# EAGLE design HVIBDC (EAGLE 9.5.1)
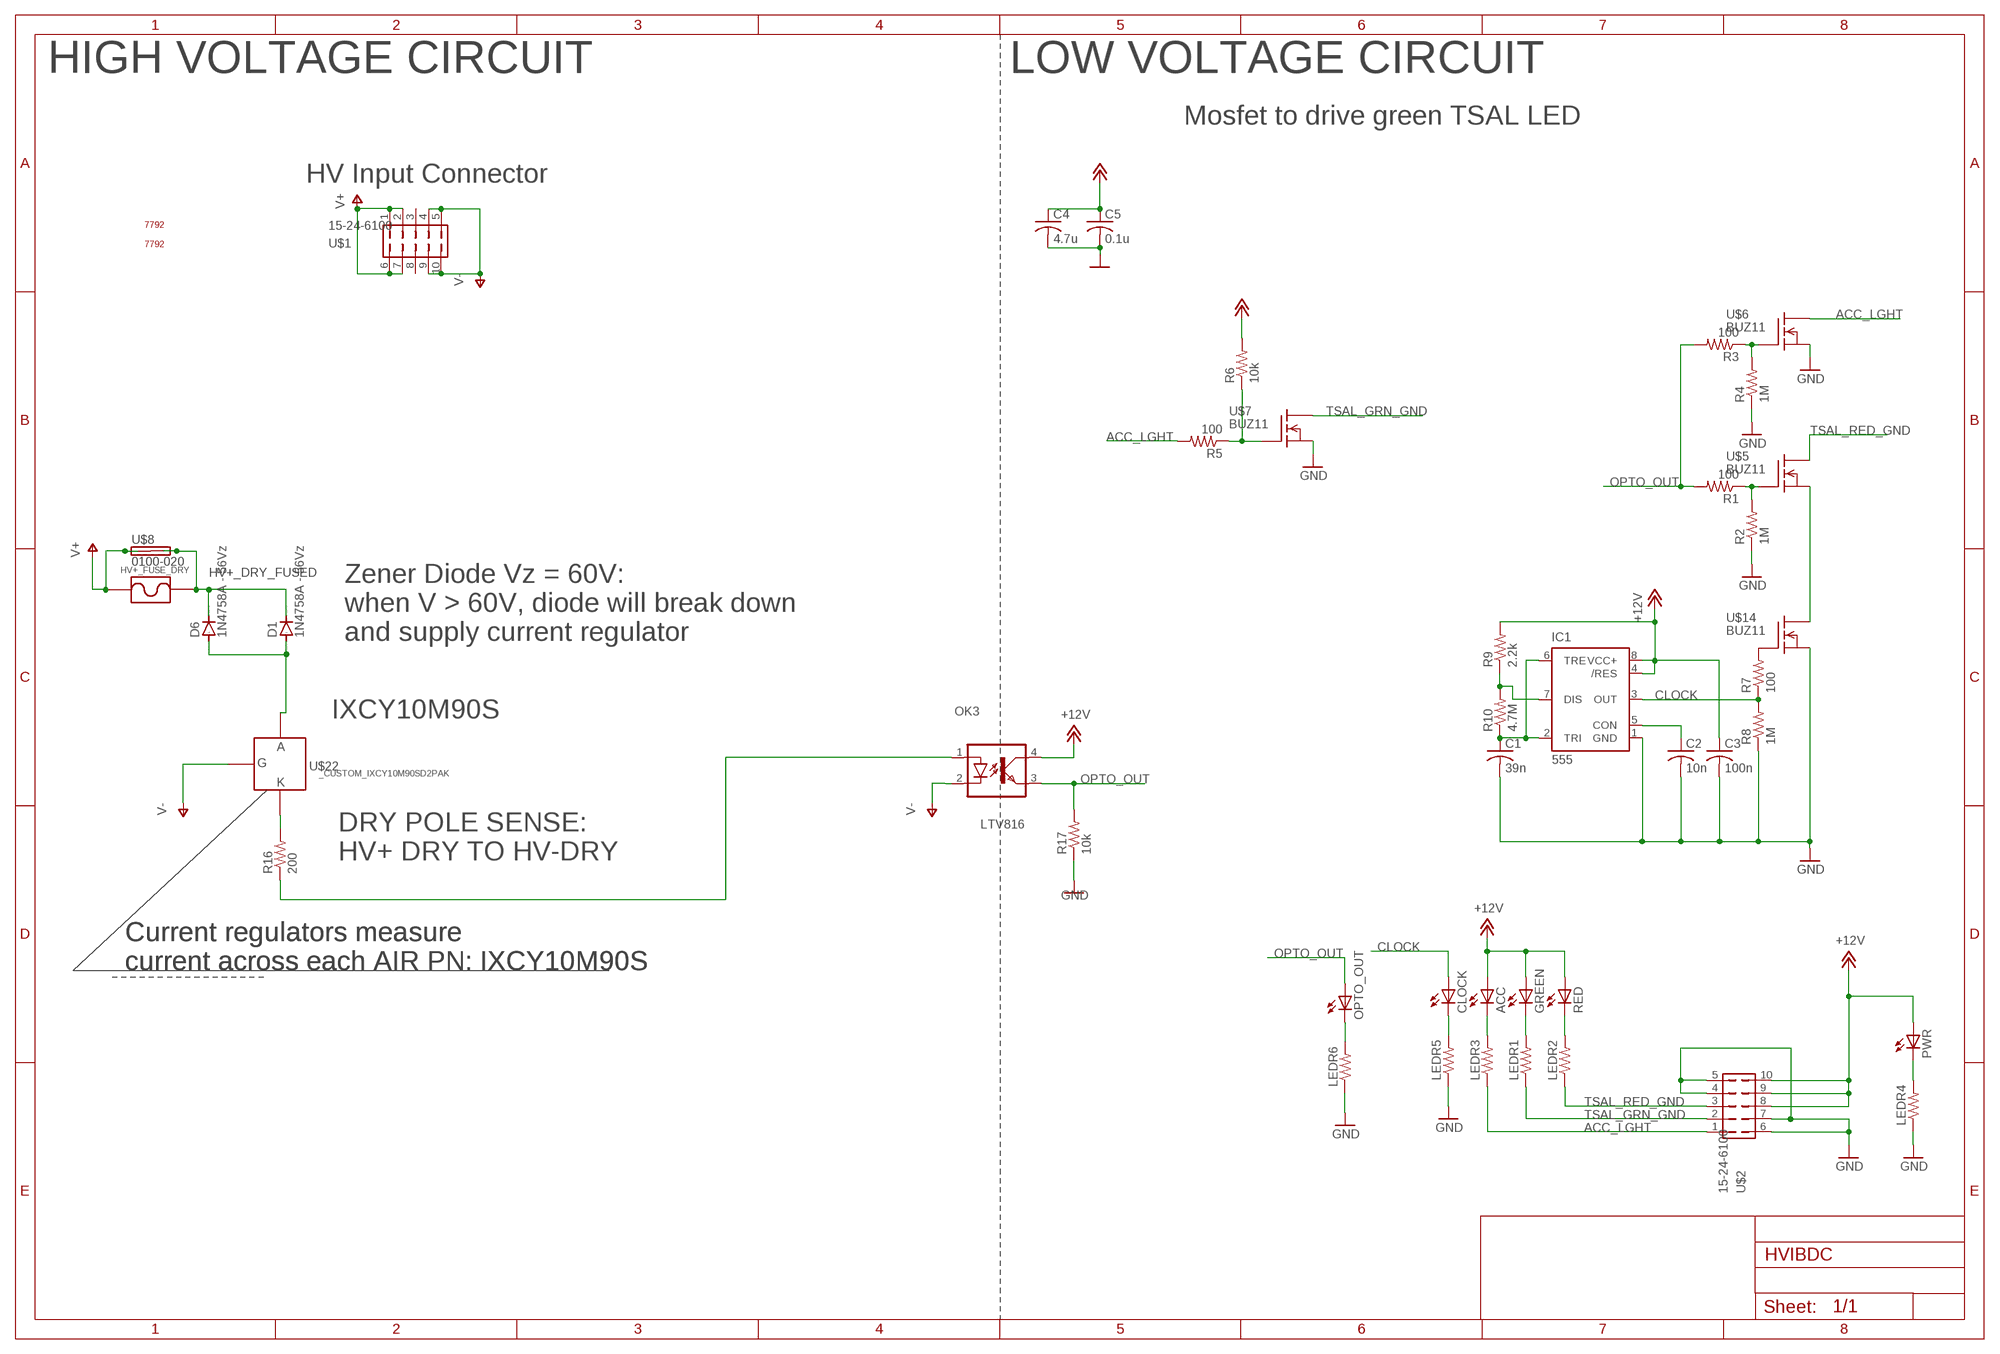
[diagram p0: schematic, sheet 1]

## Parts
ACC  LEDCHIPLED_0805  [CHIPLED_0805]
C1  39n  C-USC0805  [C0805]
C2  10n  C-USC0805  [C0805]
C3  100n  C-USC0805  [C0805]
C4  4.7u  C-USC0805  [C0805]
C5  0.1u  C-USC0805  [C0805]
CLOCK  LEDCHIPLED_0805  [CHIPLED_0805]
D1  1N4758A - 56Vz  1N5624  [DO201-15]
D6  1N4758A - 56Vz  1N5624  [DO201-15]
GREEN  LEDCHIPLED_0805  [CHIPLED_0805]
HV+_FUSE_DRY  _CUSTOM_PARTS_LF_885  [_CUSTOM_PARTS_LF_885]
IC1  555  555P  [DIP08]
LEDR1  R-US_R0805  [R0805]
LEDR2  R-US_R0805  [R0805]
LEDR3  R-US_R0805  [R0805]
LEDR4  R-US_R0805  [R0805]
LEDR5  R-US_R0805  [R0805]
LEDR6  R-US_R0805  [R0805]
OK3  LTV816  [DIL04]
OPTO_OUT  LEDCHIPLED_0805  [CHIPLED_0805]
PWR  LEDCHIPLED_0805  [CHIPLED_0805]
R1  100  R-US_R0805  [R0805]
R2  1M  R-US_R0805  [R0805]
R3  100  R-US_R0805  [R0805]
R4  1M  R-US_R0805  [R0805]
R5  100  R-US_R0805  [R0805]
R6  10k  R-US_R0805  [R0805]
R7  100  R-US_R0805  [R0805]
R8  1M  R-US_R0805  [R0805]
R9  2.2k  R-US_R0805  [R0805]
R10  4.7M  R-US_R0805  [R0805]
R16  200  R-US_R2010  [R2010]
R17  10k  R-US_R0805  [R0805]
RED  LEDCHIPLED_0805  [CHIPLED_0805]
U$1  15-24-6100  [15-24-6100]
U$2  15-24-6100  [15-24-6100]
U$3  7792  [7792]
U$4  7792  [7792]
U$5  BUZ11  [TO220]
U$6  BUZ11  [TO220]
U$7  BUZ11  [TO220]
U$8  0100-020  [0100-020]
U$14  BUZ11  [TO220]
U$22  _CUSTOM_IXCY10M90SD2PAK  [TO228P991X238-3]

## Nets
+12V: ACC.A C3.1 C4.1 C5.1 GREEN.A IC1.4(/RES) IC1.8(VCC+) OK3.4(COL) PWR.A R6.2 R9.2 RED.A U$2.8 U$2.9 U$2.10
ACC_LGHT: LEDR3.1 R5.2 U$2.1 U$6.2(D)
CLOCK: CLOCK.A IC1.3(OUT) R7.1 R8.2
GND: C1.2 C2.2 C3.2 C4.2 C5.2 IC1.1(GND) LEDR4.1 LEDR5.1 LEDR6.1 R2.1 R4.1 R8.1 R17.1 U$2.4 U$2.5 U$2.6 U$2.7 U$6.3(S) U$7.3(S) U$14.3(S)
HV+_DRY_FUSED [HV]: D1.C D6.C HV+_FUSE_DRY.P$1 U$8.P$2(2A) U$8.P$4(2B)
N$1: R1.1 R2.2 U$5.1(G)
N$2: R3.1 R4.2 U$6.1(G)
N$3: R5.1 R6.1 U$7.1(G)
N$4: C2.1 IC1.5(CON)
N$5: IC1.7(DIS) R9.1 R10.2
N$6: CLOCK.C LEDR5.2
N$7: R7.2 U$14.1(G)
N$8: LEDR6.2 OPTO_OUT.C
N$9: C1.1 IC1.2(TRI) IC1.6(TRE) R10.1
N$10: ACC.C LEDR3.2
N$12: GREEN.C LEDR1.2
N$13: U$5.3(S) U$14.2(D)
N$16: LEDR2.2 RED.C
N$17: LEDR4.2 PWR.C
N$20 [HV]: R16.2 U$22.2(K)
N$21 [HV]: D1.A D6.A U$22.3(A)
N$22 [HV]: OK3.1(A) R16.1
OPTO_OUT: OK3.3(EMIT) OPTO_OUT.A R1.2 R3.2 R17.2
TSAL_GRN_GND: LEDR1.1 U$2.2 U$7.2(D)
TSAL_RED_GND: LEDR2.1 U$2.3 U$5.2(D)
V+ [HV]: HV+_FUSE_DRY.P$2 U$1.1 U$1.2 U$1.6 U$1.7 U$8.P$1(1A) U$8.P$3(1B)
V- [HV]: OK3.2(C) U$1.4 U$1.5 U$1.9 U$1.10 U$22.1(G)
Unconnected: U$1.3 U$1.8

## Notes on the sheet
- HIGH VOLTAGE CIRCUIT | LOW VOLTAGE CIRCUIT
- Mosfet to drive green TSAL LED
- HV Input Connector
- Zener Diode Vz = 60V: 
  when V > 60V, diode will break down 
  and supply current regulator
- IXCY10M90S
- DRY POLE SENSE:
  HV+ DRY TO HV-DRY
- Current regulators measure 
  current across each AIR PN: IXCY10M90S
- Current regulators measure 
  current across each AIR PN: IXCY10M90S
- Current regulators measure 
  current across each AIR PN: IXCY10M90S

## Library data of the parts
ACC CLOCK GREEN OPTO_OUT PWR RED = ACC-MB-R0:LED: LED OSRAM: - CHIPLED LG R971, LG N971, LY N971, LG Q971, LY Q971, LO R971, LY R971 LH N974, LH R974 LS Q976, LO Q976, LY Q976 LO Q996 - Hyper CHIPLED LW Q18S LB Q993, LB Q99A, LB R99A - SideLED LS A670, LO A670, LY A670, LG A670, LP A670 LB A673, LV A673, LT A673, LW A673 LH A674 LY A675 LS A676, LA A676, LO A676, LY A676, LW A676 LS A679, LY A679, LG A679 - Hyper Micro SIDELED® LS Y876, LA Y876, LO Y876, LY Y876 LT Y87S - SmartLED LW L88C, LW L88S LB L89C, LB L89S, LG L890 LS L89K, LO L89K, LY L89K LS L896, LA L896, LO L896, LY L896 - TOPLED LS T670, LO T670, LY T670, LG T670, LP T670 LSG T670, LSP T670, LSY T670, LOP T670, LYG T670 LG T671, LOG T671, LSG T671 LB T673, LV T673, LT T673, LW T673 LH T674 LS T676, LA T676, LO T676, LY T676, LB T676, LH T676, LSB T676, LW T676 LB T67C, LV T67C, LT T67C, LS T67K, LO T67K, LY T67K, LW E67C LS E67B, LA E67B, LO E67B, LY E67B, LB E67C, LV E67C, LT E67C LW T67C LS T679, LY T679, LG T679 LS T770, LO T770, LY T770, LG T770, LP T770 LB T773, LV T773, LT T773, LW T773 LH T774 LS E675, LA E675, LY E675, LS T675 LS T776, LA T776, LO T776, LY T776, LB T776 LHGB T686 LT T68C, LB T68C - Hyper Mini TOPLED® LB M676 - Mini TOPLED Santana® LG M470 LS M47K, LO M47K, LY M47K Source: http://www.osram.convergy.de LUXEON: - LUMILED® LXK2-PW12-R00, LXK2-PW12-S00, LXK2-PW14-U00, LXK2-PW14-V00 LXK2-PM12-R00, LXK2-PM12-S00, LXK2-PM14-U00 LXK2-PE12-Q00, LXK2-PE12-R00, LXK2-PE12-S00, LXK2-PE14-T00, LXK2-PE14-U00 LXK2-PB12-K00, LXK2-PB12-L00, LXK2-PB12-M00, LXK2-PB14-N00, LXK2-PB14-P00, LXK2-PB14-Q00 LXK2-PR12-L00, LXK2-PR12-M00, LXK2-PR14-Q00, LXK2-PR14-R00 LXK2-PD12-Q00, LXK2-PD12-R00, LXK2-PD12-S00 LXK2-PH12-R00, LXK2-PH12-S00 LXK2-PL12-P00, LXK2-PL12-Q00, LXK2-PL12-R00 Source: www.luxeon.com KINGBRIGHT: KA-3528ASYC Source: www.kingbright.com
C1-C5 = resistor:C-US: CAPACITOR, American symbol
D1 D6 = diode:1N5624: DIODE controlled avalanche rectifier
HV+_FUSE_DRY = Main:_CUSTOM_PARTS_LF_885
IC1 = SparkFun-IC-Special-Function:555: General purpose bipolar Timer Datasheet <http://www.sparkfun.com/datasheets/Components/General/ne555.pdf> SparkFun Products SparkFun SparkPunk Sequencer Kit <https://www.sparkfun.com/products/12707> (KIT-12707) Storefront Component: 555 Timer <https://www.sparkfun.com/products/9273> (COM-09273) Two parts valid for production: VFP: IC-11930 (M7555 PTH) VFP: IC-09173 (555 PTH) - Preferred; PROD_ID: IC-09173; PROD_ID_ALT: IC-09173
LEDR1-LEDR6 = ACC-MB-R0:R-US_: RESISTOR, American symbol; SPICEPREFIX: R
OK3 = optocoupler:LTV816: OPTO COUPLER Source: LITEON, LTV816.pdf; OC_FARNELL: unknown; OC_NEWARK: unknown
R1-R10 R17 = resistor:R-US_: RESISTOR, American symbol
R16 = Main:R-US_: RESISTOR, American symbol; SPICEPREFIX: R
U$1 U$2 = ACC-MB-R0:15-24-6100
U$3 U$4 = ACC-MB-R0:7792
U$5-U$7 U$14 = transistor-fet:BUZ11: N-Channel Enhancement MOSFET 50V; 30A; 0,040Ohm
U$8 = ACC-MB-R0:0100-020
U$22 = Main:_CUSTOM_IXCY10M90S

## Net classes
0 default: width 0.2 mm, clearance 0.2 mm
2 HV: width 1.27 mm, clearance 1.5 mm to class 0, clearance 1.5 mm to class 1, clearance 1.5 mm

## Board
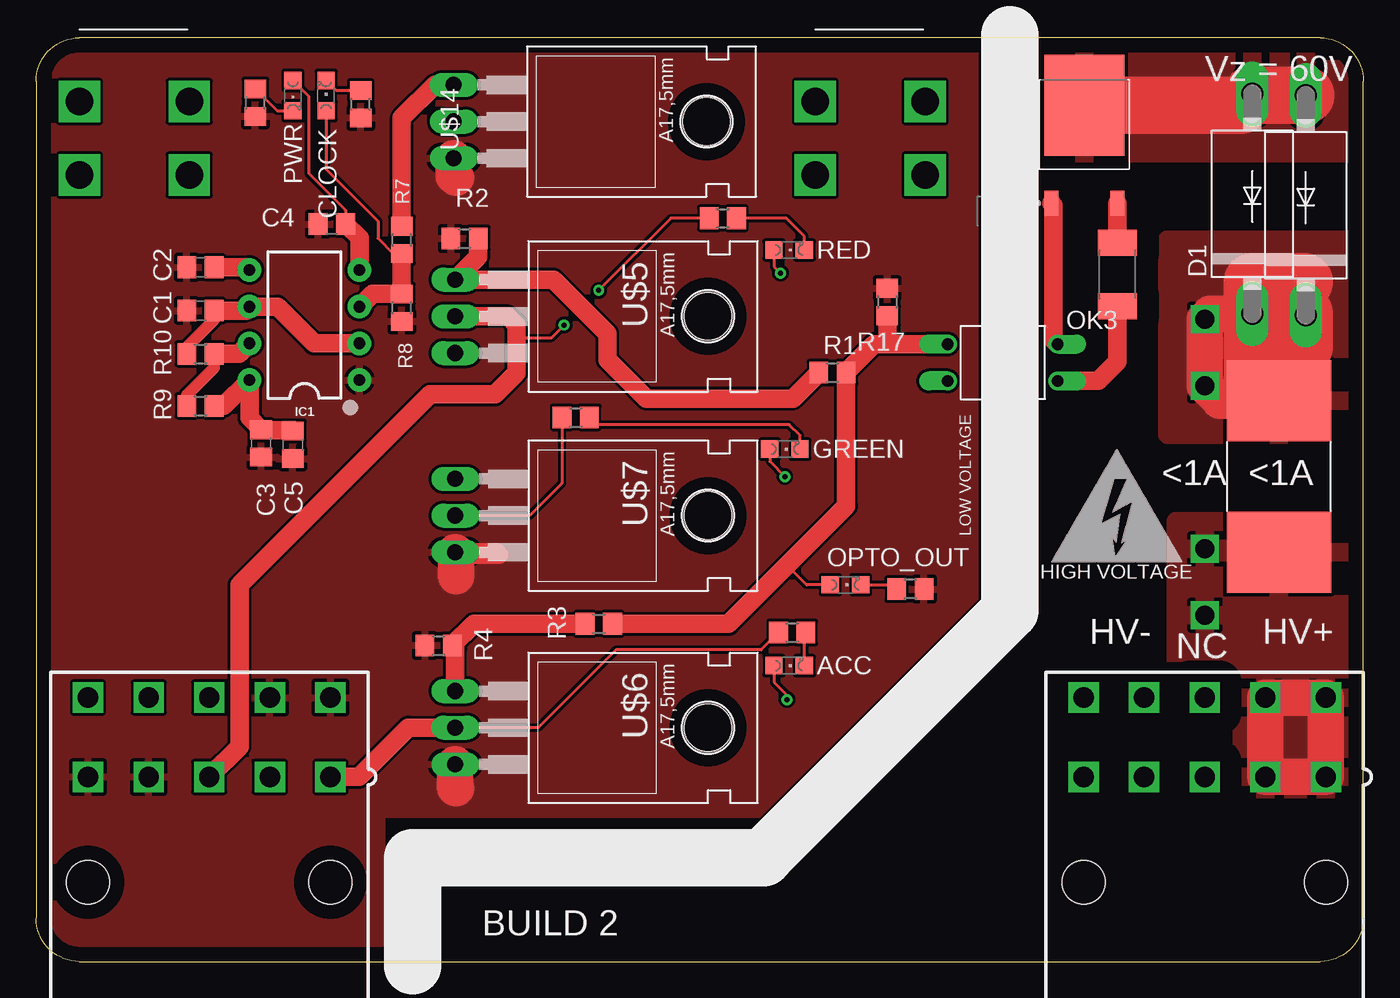
[diagram p1: board, top side]
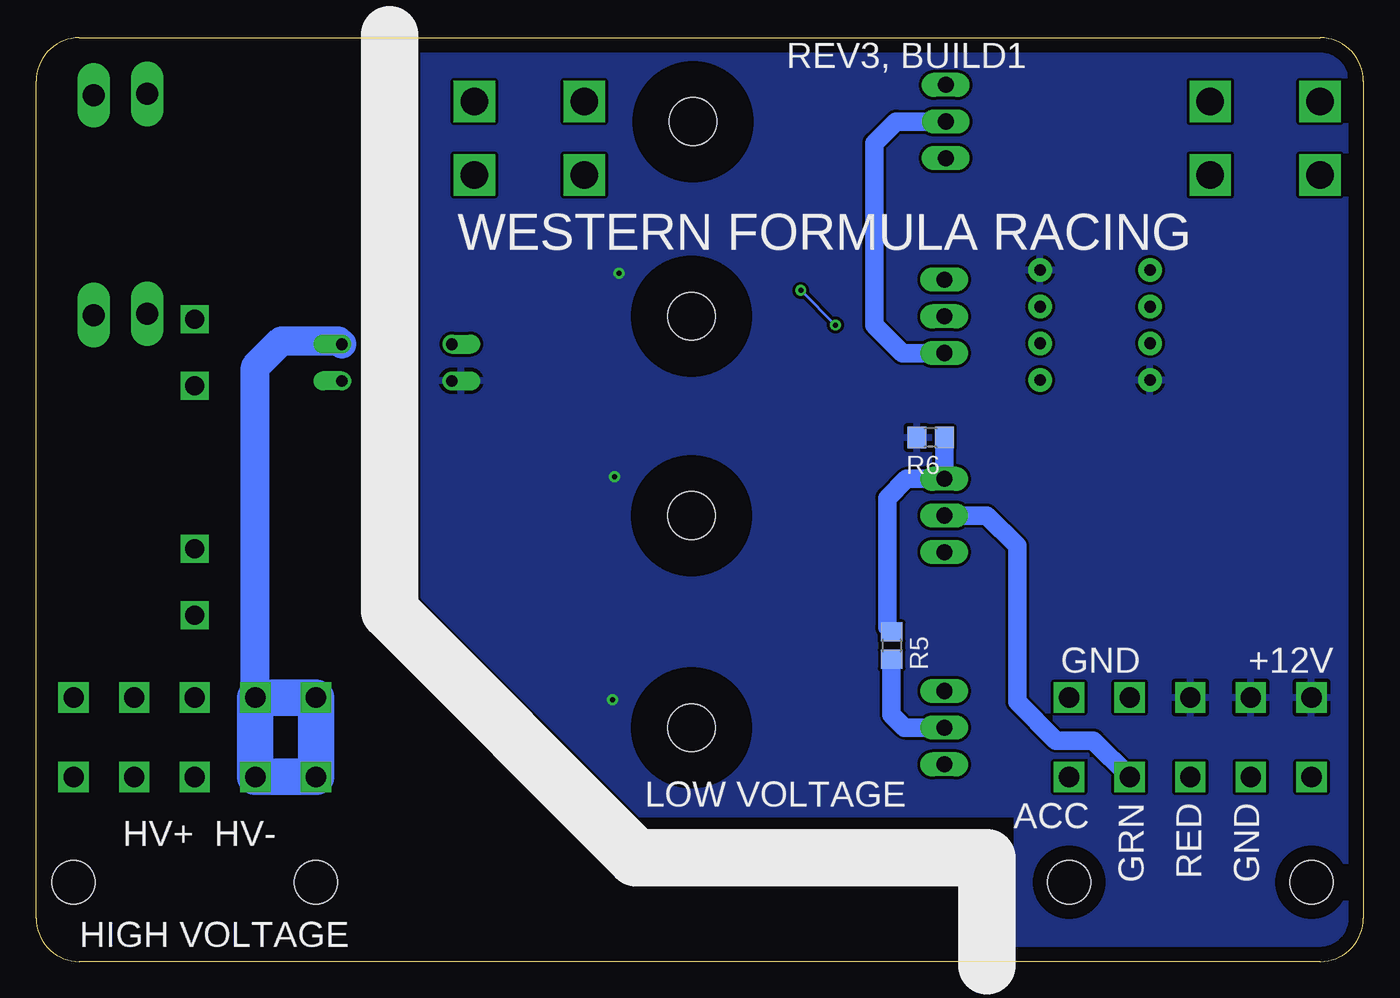
[diagram p2: board, bottom side, seen from below]

Size 92 x 64 mm. Coordinates in mm from the lower left corner, seen from the top.
Outline: 3,0 89,0 arc90 92,3 92,61 arc90 89,64 3,64 arc90 0,61 0,3 arc90 3,0
Copper layers (1*16): Top 0.035mm / dielectric 1.5mm / Bottom 0.035mm
Design rules "default": minimum track width 6mil, minimum drill 0.35mm, track to track 6mil, track to pad 6mil, pad to pad 6mil, via to via 6mil, smd to smd 6mil, copper to edge 40mil, drill to drill 6mil, minimum pad ring 10mil, minimum via ring 8mil, stop-mask expansion 4mil, vias tented up to drill 0mil, thermal gap 10mil

### Footprints (pad centres in the part's own frame; a part is rotated, then mirrored left to right if it is on the bottom)
CHIPLED_0805 = smd 1.2 x 1.2: A 0,-1.05; C 0,1.05
C0805 = smd 1.3 x 1.5: 1 -0.95,0; 2 0.95,0
DO201-15 = drill 1.499 long: A 7.62,0; C -7.62,0
_CUSTOM_PARTS_LF_885 = smd 5.6 x 7.23: P$1 5.25,0; P$2 -5.25,0
DIP08 = drill 0.813 pad 1.626: 1 -3.81,-3.81; 2 -1.27,-3.81; 3 1.27,-3.81; 4 3.81,-3.81; 5 3.81,3.81; 6 1.27,3.81; 7 -1.27,3.81; 8 -3.81,3.81
R0805 = smd 1.3 x 1.5: 1 -0.95,0; 2 0.95,0
DIL04 = drill 0.813 offset: 1 -1.27,-3.81; 2 1.27,-3.81; 3 1.27,3.81; 4 -1.27,3.81
R2010 = smd 1.8 x 2.7: 1 -2.2,0; 2 2.2,0
15-24-6100 = drill 1.4 square: 1 8.4,-2.75; 2 4.2,-2.75; 3 0,-2.75; 4 -4.2,-2.75; 5 -8.4,-2.75; 6 8.4,2.75; 7 4.2,2.75; 8 0,2.75; 9 -4.2,2.75; 10 -8.4,2.75 | hole 3: 8.4,-10.05; -8.4,-10.05
7792 = drill 1.905 square: P$1 0,5.08; P$2 7.62,5.08; P$3 7.62,0; P$4 0,0
TO220 = drill 1.118 long: 1 -2.54,-6.35; 2 0,-6.35; 3 2.54,-6.35 | hole 3.302: 0,11.176
0100-020 = drill 1.3 square: P$1 0,0; P$2 15.9,0; P$3 4.6,0; P$4 20.5,0
TO228P991X238-3 = smd 1.718 x 0.974: 1 -4.704,2.28; 2 -4.704,-2.28 | smd 7.001 x 5.544: 3 2.063,0

### Placement (x,y rotation side)
ACC  52.2,20.5 270 top
C1  11.4,45.1 180 top
C2  11.4,48.1 180 top
C3  15.6,35.9 270 top
C4  20.5,51.1 180 top
C5  17.8,35.8 270 top
CLOCK  20.1,60 0 top
D1  84.3,52.5 90 top
D6  88,52.4 90 top
GREEN  51.9,35.5 270 top
HV+_FUSE_DRY  86.15,33.6 90 top
IC1  18.6,44.1 90 top
LEDR1  37.4,37.7 0 top
LEDR2  47.6,51.5 0 top
LEDR3  52.4,22.8 0 top
LEDR4  15.2,59.5 90 top
LEDR5  22.5,59.4 90 top
LEDR6  60.6,25.8 180 top
OK3  67,41.5 90 top
OPTO_OUT  56.1,26.1 270 top
PWR  17.8,60 180 top
R1  55.2,40.8 0 top
R2  29.7,50.1 0 top
R3  39,23.4 0 top
R4  27.9,21.9 0 top
R5  32.7,21.9 270 bottom
R6  30,36.3 180 bottom
R7  25.35,50 90 top
R8  25.35,45.3 90 top
R9  11.4,38.5 0 top
R10  11.4,42.1 0 top
R16  74.95,47.6 90 top
R17  59,45.7 270 top
RED  52.2,49.3 270 top
U$1  81,15.54 0 top
U$2  12,15.54 0 top
U$3  54,54.5 0 top
U$4  3,54.5 0 top
U$5  35.4,44.7 270 top
U$6  35.4,16.2 270 top
U$7  35.4,30.9 270 top
U$8  81,24 90 top
U$14  35.3,58.2 270 top
U$22  72.65,57.25 90 top

### Tracks (layer width: path | path; a pad name or v marks a point on that pad's centre or on a via)
+12V  (via drill 0.35)
  Top 0.2: PWR.A 18.9,59.95 18.9,54.6 21.45,52.05 C4.1 | RED.A 51.15,48.15 v51.6,47.7 | GREEN.A 50.85,34.65 v51.9,33.6 | ACC.A 51.15,19.35 52.2,18.3 v52.05,18.15
  Top 1: 17.85,36.8 C5.1
  Top 1.27: 17.85,36.8 15.65,36.8 C3.1 14.79,37.66 IC1.8 13,38.5 R9.2 | IC1.4 22.41,50.14 C4.1
  pour Bottom: -5.4,-8.1 24,-8.1 24,10.2 50.1,10.2 65.1,25.2 65.1,67.2 -3.6,67.2 -3.6,-3 -5.4,-4.8
ACC_LGHT
  Top 0.2: LEDR3.1 50.25,21.6 40.2,21.6 34.8,16.2 U$6.2
  Top 1.27: U$2.1 22.39,12.79 25.8,16.2 U$6.2
  Bottom 1.27: R5.2 32.7,17.1 31.8,16.2 U$6.2
CLOCK
  Top 0.2: CLOCK.A 20.1,54.9 23.7,51.3 23.7,50.1 24.75,49.05 R7.1
  Top 1.27: IC1.3 23.31,46.27 25.33,46.27 R8.2 R7.1
GND
  Top 1.27: U$7.3 31.94,28.36 32.1,28.2 29.21,28.2 U$7.3
  Top 2.54: U$7.3 29.1,28.31 29.1,26.7 | U$6.3 29.05,12.05 29.1,12 | U$14.3 28.95,54.45 29.1,54.3
  pour Top: -5.4,-8.1 24,-8.1 24,10.2 50.1,10.2 65.1,25.2 65.1,66 -3.6,66 -3.6,-3 -5.4,-4.8
HV+_DRY_FUSED
  Top 2.54: HV+_FUSE_DRY.P$1 82.05,38.85 U$8.P$2 U$8.P$4 81.38,44.88 D1.C | 87.9,44.88 D6.C
  Top 4: 87.9,44.88 87.9,42.6 84.9,39.6 84.3,40.2 D1.C 84.3,47.1 87.9,47.1
  pour Top: 78.4,36.5 96,36.5 96,50 78.4,50
N$1
  Top 1.27: R2.2 30.65,48.84 U$5.1 35.86,47.24 39.6,43.5 39.6,41.7 42.3,39 52.45,39 R1.1
N$2
  Top 1.27: U$6.1 29.05,21.7 R4.2 30.35,23.4 R3.1
N$3
  Bottom 1.27: R5.1 33,23.15 33,32.1 31.66,33.44 U$7.1 R6.1
N$4
  Top 1.27: C2.1 14.6,48.1 IC1.5
N$5
  Top 0.813: R9.1 10.45,39.25 12.35,41.15 R10.2
  Top 1: R9.1 10.45,38.99
  Top 1.27: R10.2 14.06,42.1 IC1.7
N$6
  Top 0.2: CLOCK.C 20.8,60.35 LEDR5.2
N$7
  Top 1.27: U$14.1 27.64,60.74 25.35,58.45 R7.2
N$8
  Top 0.2: OPTO_OUT.C 59.35,26.1 LEDR6.2
N$9
  Top 0.813: R10.1 10.45,42.55 12.35,44.45 C1.1
  Top 1.27: C1.1 14.52,45.1 IC1.6 16.73,45.37 19.27,42.83 IC1.2
N$10
  Top 0.2: 53.35,20.4 ACC.C 53.25,22.7 LEDR3.2
N$12
  Top 0.2: GREEN.C 52.95,36.45 52.2,37.2 38.85,37.2 LEDR1.2
N$13
  Bottom 1.27: U$5.3 31.96,42.16 33.9,44.1 33.9,56.7 32.4,58.2 U$14.2
N$16
  Top 0.2: RED.C 53.25,50.25 52,51.5 LEDR2.2
N$17
  Top 0.2: 17.5,58.95 PWR.C 16.7,58.95 LEDR4.2
N$20
  Top 1.27: R16.2 74.95,52.53 U$22.2
N$21
  Top 4: D6.A 84.4,60.02 D1.A 83.49,59.31 78.6,59.31 | 78.6,59.31 U$22.3 | 78.6,59.31
  pour Top: 71,66 71,56 95,56 95,66
N$22
  Top 1.27: OK3.1 73.63,40.23 74.95,41.55 R16.1
OPTO_OUT
  Top 0.2: OPTO_OUT.A 53.4,26.1 52.05,27.45
  Top 1.27: R17.2 59,42.77 OK3.3 58.09,42.77 56.15,40.83 R1.2 56.15,31.55 52.05,27.45 48,23.4 R3.2
TSAL_GRN_GND
  Top 0.2: LEDR1.1 36.45,33.15 34.2,30.9 U$7.2
  Bottom 1.27: U$2.2 18.71,15.3 21.3,15.3 24,18 24,28.8 26.1,30.9 U$7.2
TSAL_RED_GND  (via drill 0.35)
  Top 0.2: LEDR2.1 44,51.5 v39,46.5 | v36.6,44.1 35.7,43.2 33.3,43.2
  Top 1.27: U$2.3 14.1,14.89 14.1,26.1 27.3,39.3 31.8,39.3 33.3,40.8 33.3,43.2 33.3,44.1 32.7,44.7 U$5.2
  Bottom 0.2: v39,46.5 v36.6,44.1
V+
  Top 2.54: U$1.7 U$1.6 U$1.1 U$1.2 U$1.7
  pour Top: 79,11.95 96,11.95 96,30.5 79,30.5
V-
  Top 1.27: U$22.1 70.51,52.41 70.51,43.07 OK3.2
  Bottom 2: U$1.9 76.8,41.2 75,43 71.04,43 OK3.2
  Bottom 2.54: U$1.9 U$1.10 U$1.5 U$1.4 U$1.9

### Text on the board
tPlace: LOW VOLTAGE | HIGH VOLTAGE
tNames: Vz = 60V | <1A | <1A | HV- | HV+ | NC | BUILD 2
bNames: REV3, BUILD1 | WESTERN FORMULA RACING | +12V | GND | LOW VOLTAGE | GND | RED | GRN | ACC | HV+ HV- | HIGH VOLTAGE